# EAGLE design CAN_node_analog (EAGLE 7.2.0)
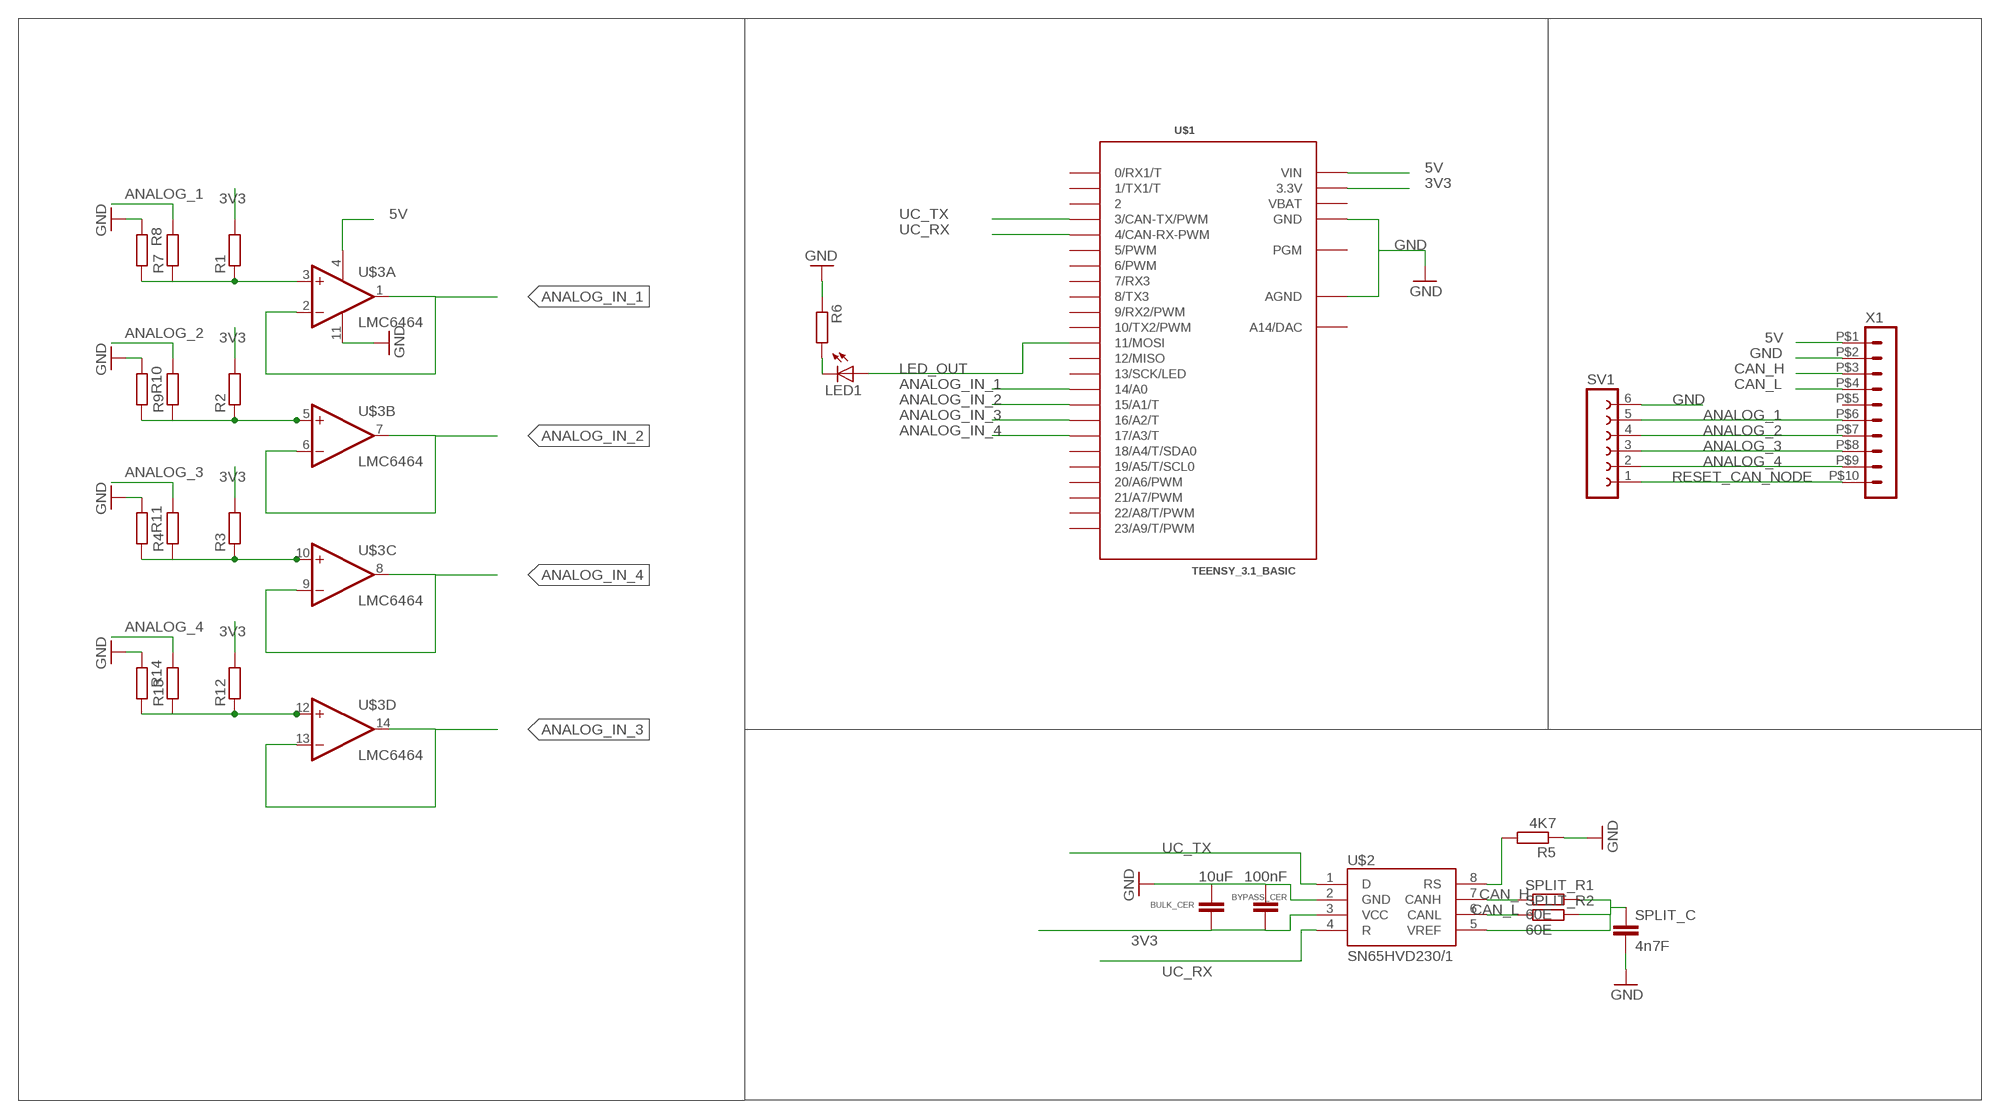
[diagram p0: schematic, sheet 1]

## Parts
BULK_CER  10uF  C-EUC0805  [C0805]
BYPASS_CER  100nF  C-EUC0805  [C0805]
LED1  LED1206  [LED-1206]
R1  R-EU_R0805  [R0805]
R2  R-EU_R0805  [R0805]
R3  R-EU_R0805  [R0805]
R4  R-EU_R0805  [R0805]
R5  4K7  R-EU_R0805  [R0805]
R6  R-EU_R0805  [R0805]
R7  R-EU_R0805  [R0805]
R8  R-EU_R0805  [R0805]
R9  R-EU_R0805  [R0805]
R10  R-EU_R0805  [R0805]
R11  R-EU_R0805  [R0805]
R12  R-EU_R0805  [R0805]
R13  R-EU_R0805  [R0805]
R14  R-EU_R0805  [R0805]
SPLIT_C  4n7F  C-EUC0805  [C0805]
SPLIT_R1  60E  R-EU_R0805  [R0805]
SPLIT_R2  60E  R-EU_R0805  [R0805]
SV1  FE06-1  [FE06]
U$1  TEENSY_3.1_BASIC  [TEENSY_3.1_BASIC]
U$2  SN65HVD230/1  [SO8]
U$3  LMC6464  [SO14_LONGPADS]
X1  HEADER_POS10_43045-1012  [43045-1012]

## Nets
3V3: BULK_CER.1 BYPASS_CER.1 R1.2 R2.2 R3.2 R12.2 U$1.3.3V U$1.3.3V1(3.3V) U$2.3(VCC)
5V: U$1.VIN U$3.4(POW:V+) X1.P$1
ANALOG_1: R7.2 SV1.5 X1.P$6
ANALOG_2: R9.2 SV1.4 X1.P$7
ANALOG_3: R4.2 SV1.3 X1.P$8
ANALOG_4: R13.2 SV1.2 X1.P$9
ANALOG_IN_1: U$1.14/A0 U$3.1(A:OUT) U$3.2(A:-IN)
ANALOG_IN_2: U$1.15/A1(15/A1/T) U$3.6(B:-IN) U$3.7(B:OUT)
ANALOG_IN_3: U$1.16/A2(16/A2/T) U$3.13(D:-IN) U$3.14(D:OUT)
ANALOG_IN_4: U$1.17/A3(17/A3/T) U$3.8(C:OUT) U$3.9(C:-IN)
CAN_H: SPLIT_R1.1 U$2.7(CANH) X1.P$3
CAN_L: SPLIT_R2.1 U$2.6(CANL) X1.P$4
GND: BULK_CER.2 BYPASS_CER.2 R5.1 R6.1 R8.1 R10.1 R11.1 R14.1 SPLIT_C.2 SV1.6 U$1.AGND U$1.GND U$1.GND1(GND) U$2.2(GND) U$3.11(POW:V-) X1.P$2
LED_OUT: LED1.A U$1.11(11/MOSI)
N$1: LED1.C R6.2
N$2: R1.1 R7.1 R8.2 U$3.3(A:+IN)
N$3: R2.1 R9.1 R10.2 U$3.5(B:+IN)
N$4: R3.1 R4.1 R11.2 U$3.10(C:+IN)
N$5: R5.2 U$2.8(RS)
N$6: R12.1 R13.1 R14.2 U$3.12(D:+IN)
N$9: SPLIT_C.1 SPLIT_R1.2 SPLIT_R2.2 U$2.5(VREF)
RESET_CAN_NODE: SV1.1 X1.P$10
UC_RX: U$1.4(4/CAN-RX-PWM) U$2.4(R)
UC_TX: U$1.3(3/CAN-TX/PWM) U$2.1(D)
Unconnected: U$1.0(0/RX1/T) U$1.1(1/TX1/T) U$1.2 U$1.5(5/PWM) U$1.6(6/PWM) U$1.7(7/RX3) U$1.8(8/TX3) U$1.9(9/RX2/PWM) U$1.10(10/TX2/PWM) U$1.12(12/MISO) U$1.13(13/SCK/LED) U$1.18/A4(18/A4/T/SDA0) U$1.19/A5(19/A5/T/SCL0) U$1.20/A6(20/A6/PWM) U$1.21/A7(21/A7/PWM) U$1.22/A8(22/A8/T/PWM) U$1.23/A9(23/A9/T/PWM) U$1.A14(A14/DAC) U$1.PGM X1.P$5

## Power pins joined to a net without a drawn wire
VBAT: U$1.VBAT

## Library data of the parts
BULK_CER BYPASS_CER SPLIT_C = LV:C-EU: CAPACITOR, European symbol
LED1 = IIT_BOMBAY_Racing:LED: LEDs Standard schematic elements and footprints for 5mm, 3mm, 1206, and 0603 sized LEDs. 5mm - Spark Fun Electronics SKU : COM-00529 (and others)
R1-R4 R6-R14 = IIT_BOMBAY_Racing:R-EU_: RESISTOR, European symbol
R5 SPLIT_R1 SPLIT_R2 = LV:R-EU_: RESISTOR, European symbol
SV1 = con-lsta:FE06-1: FEMALE HEADER; OC_FARNELL: unknown; OC_NEWARK: unknown
U$1 = IIT_BOMBAY_Racing:TEENSY_3.1_BASIC: Footprint for Teensy 3.1 board using all pin connections on the outer perimeter
U$2 = texas_1:SN65HVD230/1
U$3 = IIT_BOMBAY_Racing:LMC6464
X1 = con-molex-micro-fit-3_0:HEADER_POS10_?: Molex - Micro-Fit 3.0 Series connector, 3.00mm (0.118") pitch header, 10 positions.

## Board
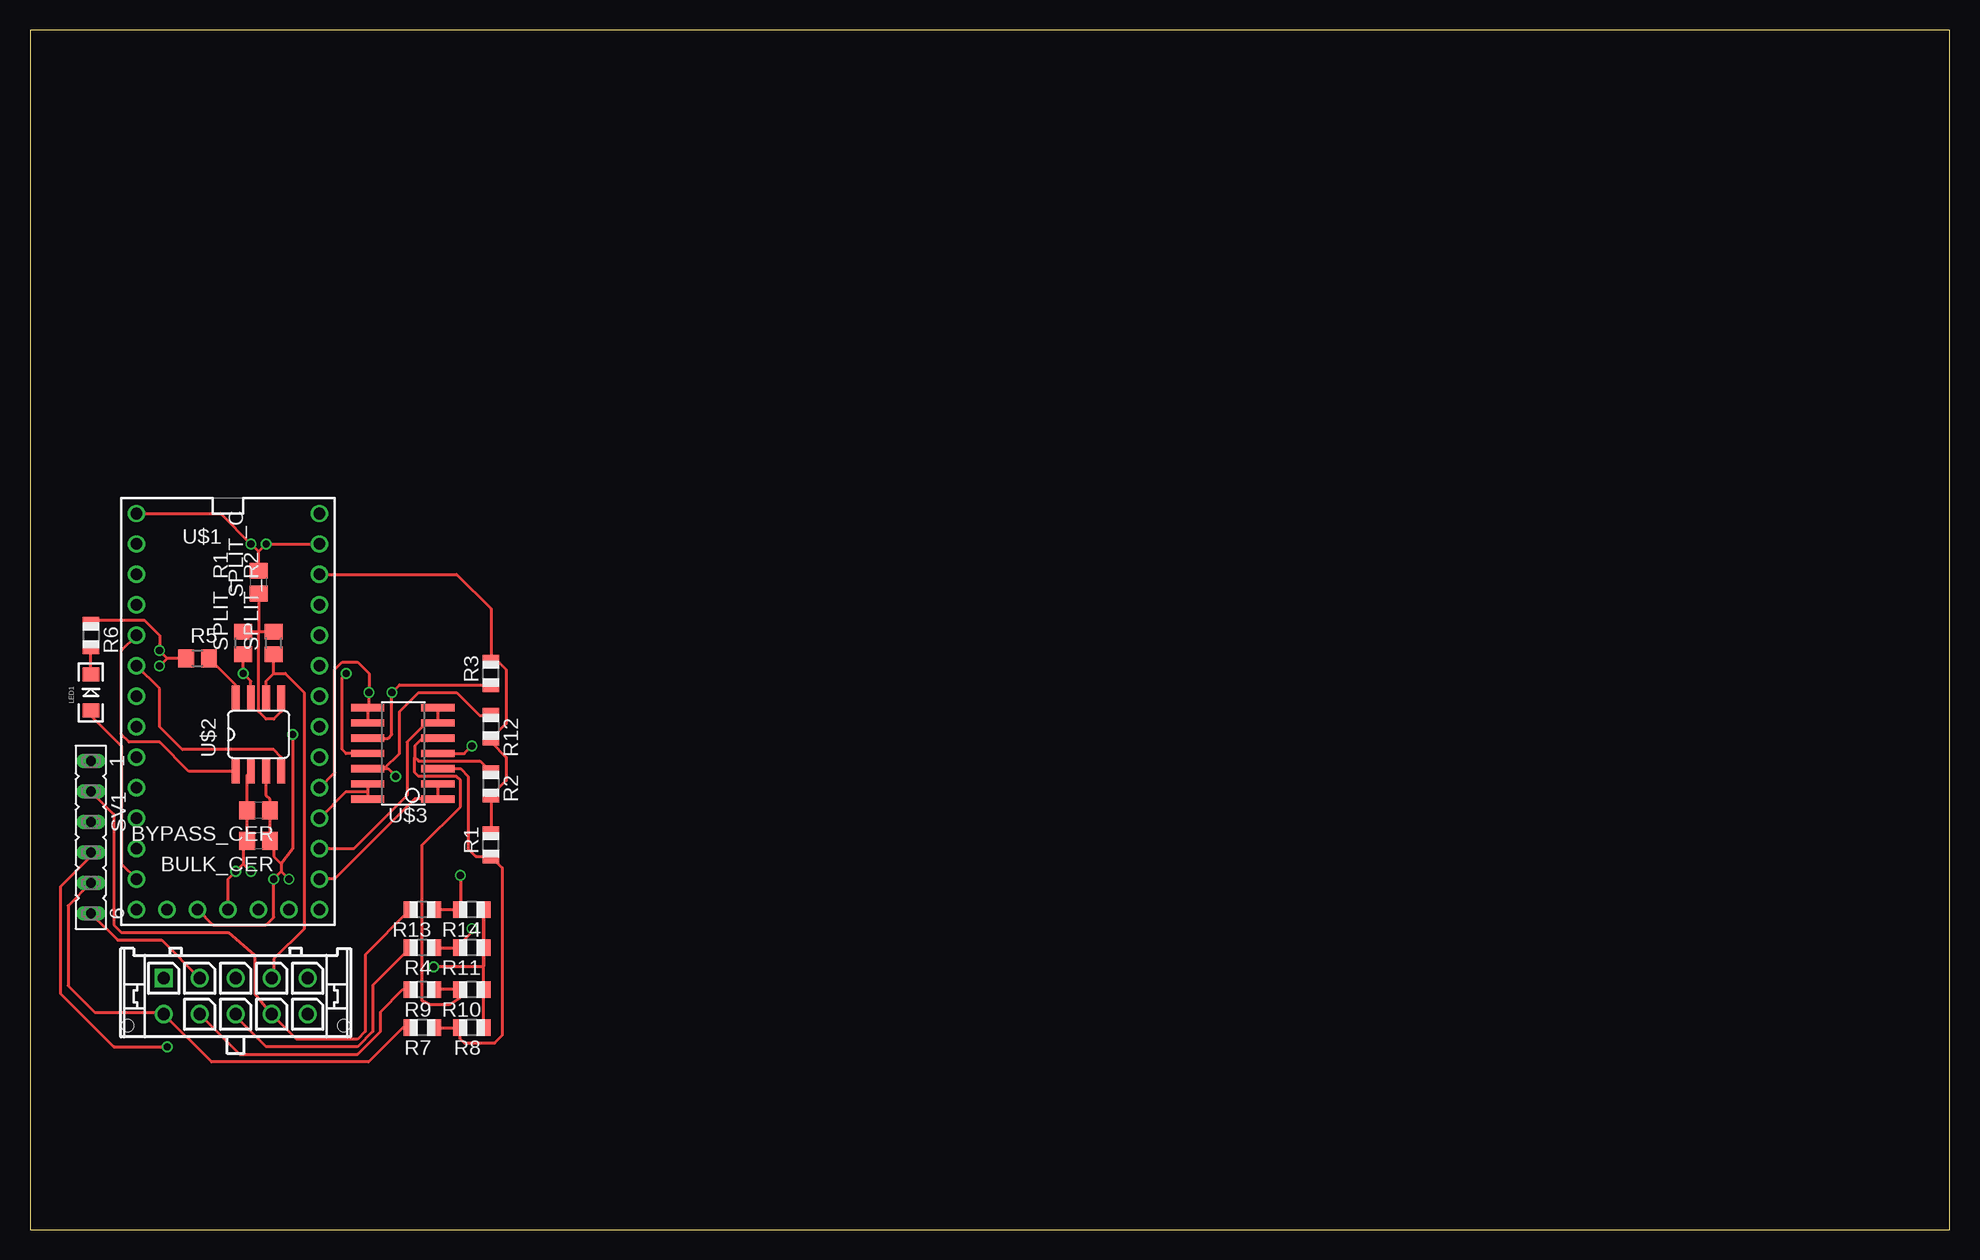
[diagram p1: board, top side]
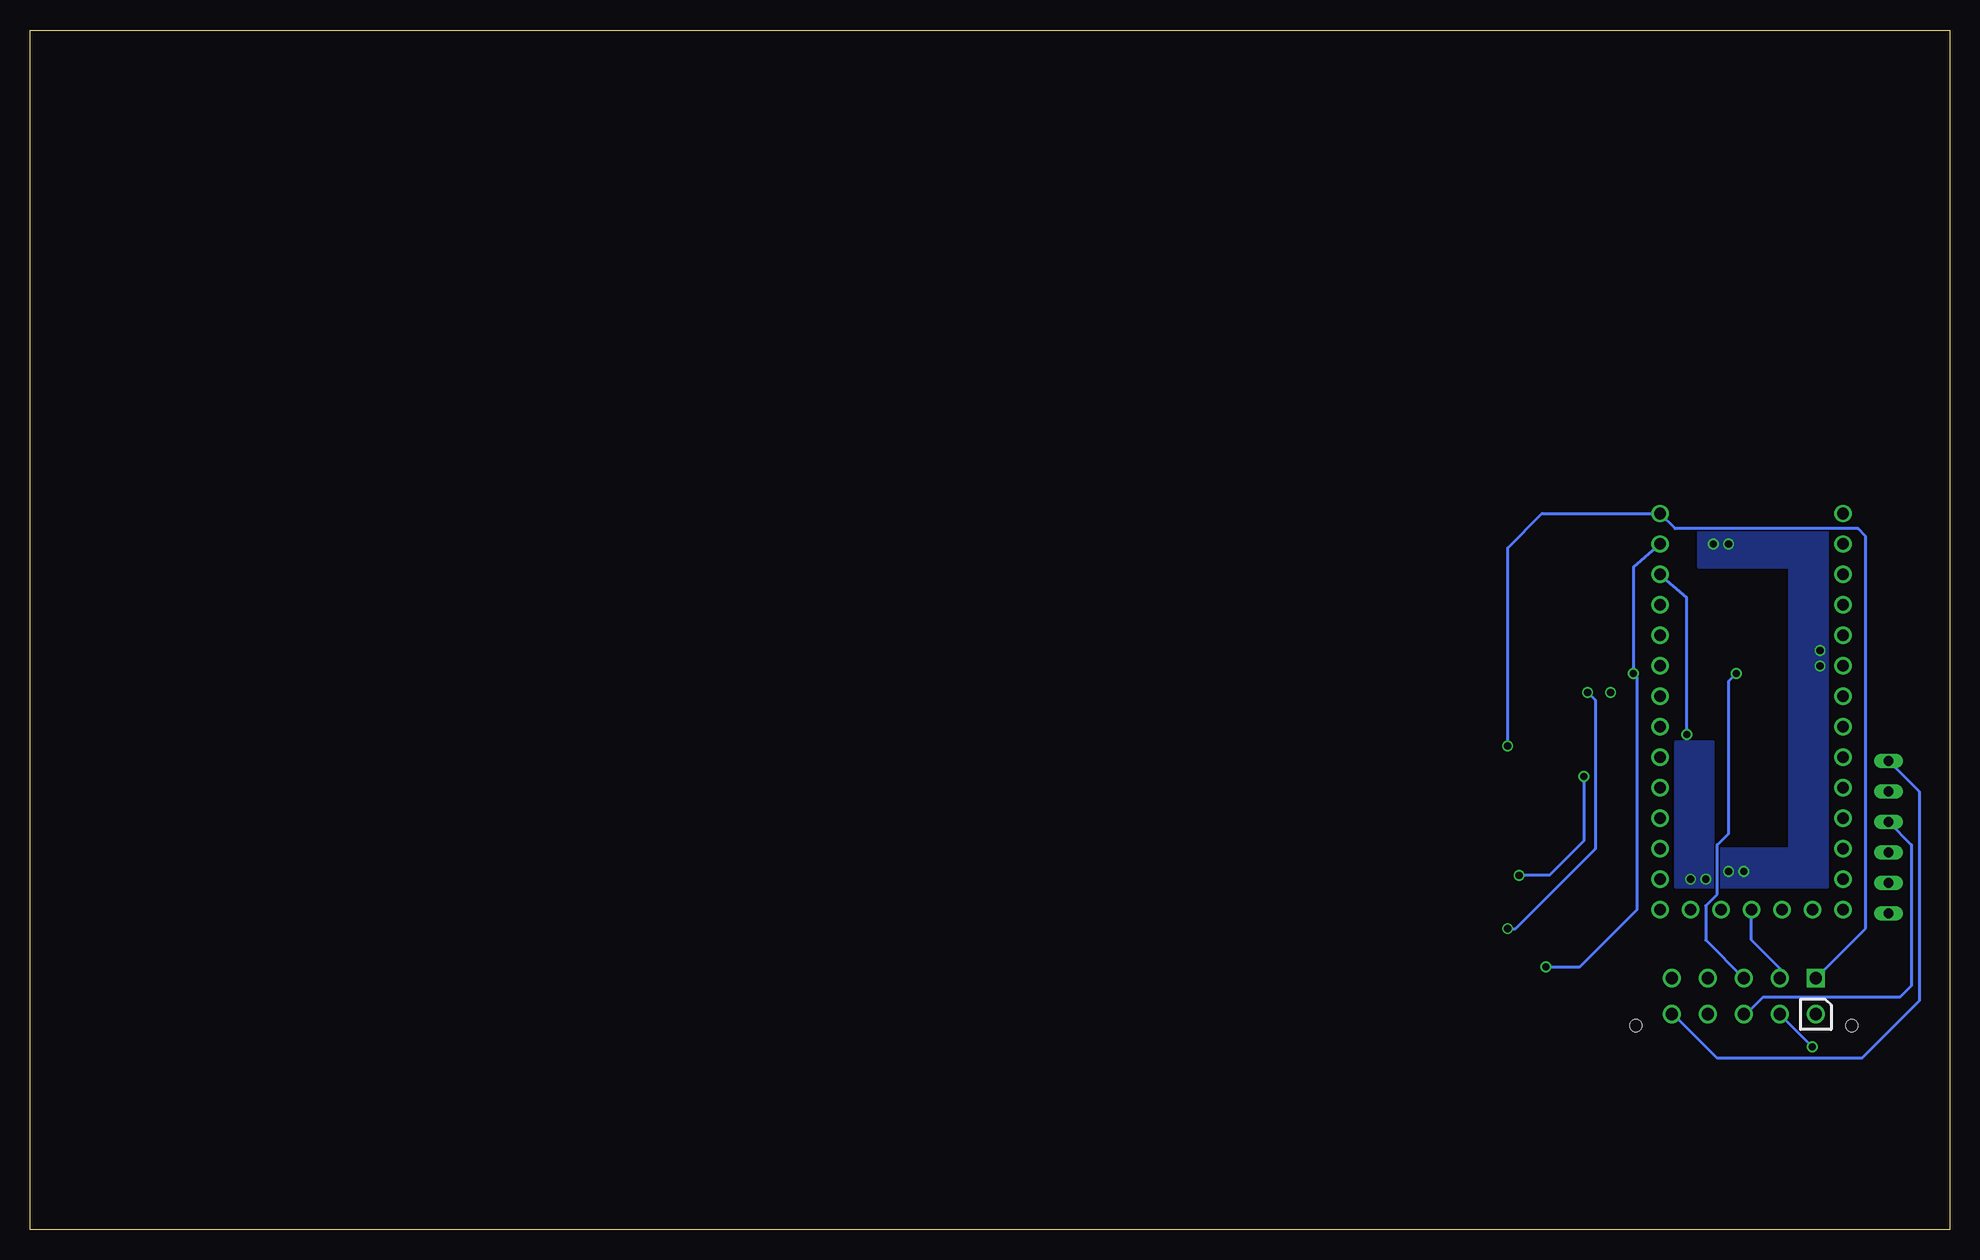
[diagram p2: board, bottom side, seen from below]

Size 160 x 100 mm. Coordinates in mm from the lower left corner, seen from the top.
Outline: 0,0 160,0 160,100 0,100 0,0
Copper layers (1*16): Top 0.035mm / dielectric 1.5mm / Bottom 0.035mm
Design rules "PCB_Power": minimum track width 5mil, minimum drill 10mil, track to track 5mil, track to pad 5mil, pad to pad 5mil, via to via 5mil, smd to smd 5mil, copper to edge 10mil, drill to drill 6mil, minimum pad ring 5mil, minimum via ring 5mil, stop-mask expansion 3mil, vias tented up to drill 0mil, thermal gap 10mil

### Footprints (pad centres in the part's own frame; a part is rotated, then mirrored left to right if it is on the bottom)
C0805 = smd 1.3 x 1.5: 1 -0.95,0; 2 0.95,0
LED-1206 = smd 1.2 x 1.4: A -1.5,0; C 1.5,0
R0805 = smd 1.1 x 1.4: 1 -1,0; 2 1,0
R0805' = smd 1.3 x 1.5: 1 -0.95,0; 2 0.95,0
FE06 = drill 0.813 long: 1 -6.35,0; 2 -3.81,0; 3 -1.27,0; 4 1.27,0; 5 3.81,0; 6 6.35,0
TEENSY_3.1_BASIC = drill 0.965: 0 -7.62,13.97; 1 -7.62,11.43; 2 -7.62,8.89; 3 -7.62,6.35; 3.3V 7.62,11.43; 3.3V1 -2.54,-16.51; 4 -7.62,3.81; 5 -7.62,1.27; 6 -7.62,-1.27; 7 -7.62,-3.81; 8 -7.62,-6.35; 9 -7.62,-8.89; 10 -7.62,-11.43; 11 -7.62,-13.97; 12 -7.62,-16.51; 13 7.62,-16.51; 14/A0 7.62,-13.97; 15/A1 7.62,-11.43; 16/A2 7.62,-8.89; 17/A3 7.62,-6.35; 18/A4 7.62,-3.81; 19/A5 7.62,-1.27; 20/A6 7.62,1.27; 21/A7 7.62,3.81; 22/A8 7.62,6.35; 23/A9 7.62,8.89; A14 5.08,-16.51; AGND 7.62,13.97; GND -7.62,16.51; GND1 0,-16.51; PGM 2.54,-16.51; VBAT -5.08,-16.51; VIN 7.62,16.51
SO8 = smd 0.66 x 2.032: 1 -1.905,-3.073; 2 -0.635,-3.073; 3 0.635,-3.073; 4 1.905,-3.073; 5 1.905,3.073; 6 0.635,3.073; 7 -0.635,3.073; 8 -1.905,3.073
SO14_LONGPADS = smd 0.61 x 2.762: 1 -6.35,-1.61; 2 -5.08,-1.61; 3 -3.81,-1.61; 4 -2.54,-1.61; 5 -1.27,-1.61; 6 0,-1.61; 7 1.27,-1.61; 8 1.27,4.226; 9 0,4.226; 10 -1.27,4.226; 11 -2.54,4.226; 12 -3.81,4.226; 13 -5.08,4.226; 14 -6.35,4.226
43045-1012 = drill 1.02 square: P$1 6,0 | drill 1.02: P$2 3,0; P$3 0,0; P$4 -3,0; P$5 -6,0; P$6 6,3; P$7 3,3; P$8 0,3; P$9 -3,3; P$10 -6,3 | hole 1.02: 9,3.94; -9,3.94

### Placement (x,y rotation side)
BULK_CER  19.05,32.38 180 top
BYPASS_CER  19.05,34.92 180 top
LED1  5.08,44.77 90 top
R1  38.42,32.07 90 top
R2  38.42,37.15 270 top
R3  38.42,46.35 90 top
R4  32.7,23.5 180 top
R5  4K7  [R0805']  13.97,47.62 0 top
R6  5.08,49.53 270 top
R7  32.7,16.83 180 top
R8  36.83,16.83 180 top
R9  32.7,20 180 top
R10  36.83,20 180 top
R11  36.83,23.5 180 top
R12  38.42,41.91 270 top
R13  32.7,26.67 180 top
R14  36.83,26.67 180 top
SPLIT_C  19.05,53.98 90 top
SPLIT_R1  60E  [R0805']  17.78,48.9 90 top
SPLIT_R2  60E  [R0805']  20.32,48.9 90 top
SV1  5.08,32.7 270 top
U$1  16.51,43.18 0 top
U$2  19.05,41.27 0 top
U$3  32.38,42.23 90 top
X1  17.14,20.95 180 top

### Tracks (layer width: path | path; a pad name or v marks a point on that pad's centre or on a via)
3V3  (via drill 0.6)
  Top 0.254: U$2.3 19.68,36.2 20,35.88 BYPASS_CER.1 BULK_CER.1 20.32,32.38 20.32,31.11 20.95,30.48 | 20.95,30.48 20.95,29.84 | 20.95,29.84 v20.32,29.21 20.32,26.04 19.68,25.4 15.24,25.4 U$1.3.3V1 | 20.95,29.84 v21.59,29.21 | v21.91,41.27 21.91,31.75 20.95,30.48 | R1.2 R2.2 39.69,37.42 39.69,39.37 38.42,40.64 R12.2 39.69,42.18 39.69,46.67 39.01,47.35 R3.2 38.42,51.75 35.56,54.61 U$1.3.3V
  Bottom 0.254: v21.91,41.27 21.91,52.7 U$1.3.3V
  pour Bottom: 19.68,28.57 19.68,40.64 22.86,40.64 22.86,28.57
5V  (via drill 0.6)
  Top 0.254: U$3.4 36.2,39.69 v36.83,40.32
  Bottom 0.254: X1.P$1 6.99,25.11 6.99,57.78 7.62,58.42 22.86,58.42 U$1.VIN 33.97,59.69 36.83,56.83 v36.83,40.32
ANALOG_1
  Top 0.254: 31.67,16.86 R7.2 31.07,16.83 28.21,13.97 15.13,13.97 X1.P$6 11,18.1 5.4,18.1 3.17,20.32 3.17,26.99 SV1.5
ANALOG_2  (via drill 0.6)
  Top 0.254: SV1.4 5.08,31.11 2.54,28.57 2.54,19.68 6.99,15.24 v11.43,15.24 | X1.P$7 17.5,14.61 27.3,14.61 29.21,16.51 29.21,18.14 31.07,20 R9.2
  Bottom 0.254: v11.43,15.24 X1.P$7
ANALOG_3
  Top 0.254: X1.P$8 17.14,17.78 19.68,15.24 27.3,15.24 28.57,16.51 28.57,20.37 R4.2
  Bottom 0.254: SV1.3 3.17,32.07 3.17,20.32 4.13,19.37 15.56,19.37 16.97,17.95 X1.P$8
ANALOG_4
  Top 0.254: SV1.2 6.99,34.61 6.99,25.4 7.62,24.77 16.51,24.77 18.73,22.86 18.73,19.68 X1.P$9 22.23,15.88 27.3,15.88 27.94,16.51 27.94,22.91 R13.2
ANALOG_IN_1
  Top 0.254: U$3.2 U$3.1 32.07,35.88 25.4,29.21 U$1.14/A0
ANALOG_IN_2
  Top 0.254: U$3.7 U$3.6 33.02,42.23 31.43,40.64 31.43,36.2 26.99,31.75 U$1.15/A1
ANALOG_IN_3
  Top 0.254: U$3.13 28.16,36.51 | 28.16,36.51 U$3.14 | U$1.16/A2 26.35,36.51 28.16,36.51
ANALOG_IN_4  (via drill 0.6)
  Top 0.254: U$3.9 U$3.8 28.26,43.5 v28.26,44.77 28.26,46.35 27.3,47.31 26.04,47.31 25.4,46.67 25.4,38.1 U$1.17/A3
CAN_H  (via drill 0.6)
  Top 0.254: U$2.7 18.41,45.72 v17.78,46.35 SPLIT_R1.1
  Bottom 0.254: v17.78,46.35 18.41,45.72 18.41,33.02 19.37,32.07 19.37,27.94 20.32,26.99 20.32,24.13 X1.P$3
CAN_L
  Top 0.254: 20.32,46.35 SPLIT_R2.1 | U$2.6 19.68,45.72 20.32,46.35 | 20.32,46.35 21.27,46.35 22.86,44.77 22.86,25.08 20.32,22.54 20.32,21.13 X1.P$4
GND  (via drill 0.6)
  Top 0.254: 13.34,47.62 R5.1 11.43,47.62 | v10.79,46.99 11.43,47.62 | 11.43,47.62 v10.79,48.26 10.79,49.53 9.53,50.8 5.35,50.8 R6.1 | 17.78,30.48 17.78,32.38 BULK_CER.2 BYPASS_CER.2 18.1,37.89 U$2.2 | 17.78,30.48 v17.14,29.84 16.51,29.21 U$1.GND1 | 17.78,30.48 v18.41,29.84 | 19.05,56.52 SPLIT_C.2 19.05,54.61 | 19.05,56.52 v18.41,57.15 15.88,59.69 U$1.GND | 19.05,56.52 v19.68,57.15 U$1.AGND | SV1.6 7.3,24.13 10.97,24.13 X1.P$2 | R8.1 R10.1 R11.1 R14.1 37.83,21.95 37.78,21.91 v33.66,21.91 | U$3.11 26.35,39.69 26.04,40.01 26.04,46.04 v26.35,46.35
  Bottom 0.254: X1.P$2 14.14,21.77 16.51,24.13 U$1.GND1 | v33.66,21.91 30.8,21.91 26.04,26.67 26.04,46.04 v26.35,46.35 26.35,55.24 U$1.AGND
  pour Bottom: 17.14,58.42 20.95,58.42 20.95,55.24 13.34,55.24 13.34,31.75 19.05,31.75 19.05,28.57 10.16,28.57 10.16,58.42
LED_OUT
  Top 0.254: LED1.A 5.08,42.86 7.62,40.32 7.62,30.48 U$1.11
N$1
  Top 0.254: LED1.C R6.2
N$2
  Top 0.254: R7.1 R8.2 35.83,15.92 36.2,15.56 38.73,15.56 39.37,16.19 39.37,30.16 38.42,31.11 38.37,31.11 | U$3.3 35.88,38.42 36.51,37.78 36.51,31.75 37.15,31.11 38.37,31.11 | 38.37,31.11 R1.1
N$3
  Top 0.254: R9.1 R10.2 35.83,19.32 34.92,18.73 33.34,18.73 32.7,19.05 32.7,32.07 35.88,35.24 35.88,37.47 35.56,37.78 32.38,37.78 32.07,38.1 32.07,39.37 | U$3.5 32.7,40.96 32.07,40.32 32.07,39.37 | 32.07,39.37 32.38,39.05 37.51,39.05 R2.1
N$4  (via drill 0.6)
  Top 0.254: R11.2 R4.1 35.56,23.5 36.83,24.77 v36.83,25.08 | U$3.10 29.84,40.96 30.16,41.27 v30.16,44.77 30.8,45.4 38.37,45.4 R3.1
  Bottom 0.254: v36.83,25.08 36.2,25.08 29.53,31.75 29.53,44.13 v30.16,44.77
N$5
  Top 0.254: U$2.8 17.14,45.4 R5.2
N$6  (via drill 0.6)
  Top 0.254: R13.1 R14.2 35.88,26.72 v35.88,29.53 | U$3.12 29.53,38.42 | 29.53,38.42 30.8,39.69 30.8,43.18 32.38,44.77 35.56,44.77 37.47,42.86 38.37,42.86 R12.1 | 29.53,38.42 29.84,38.42 v30.48,37.78
  Bottom 0.254: v35.88,29.53 33.34,29.53 30.48,32.38 v30.48,37.78
N$9
  Top 0.254: U$2.5 20.95,43.18 20.32,42.55 19.68,42.55 19.05,43.18 19.05,49.84 | SPLIT_R1.2 19.05,49.84 | 19.05,49.84 SPLIT_R2.2 | SPLIT_C.1 19.05,49.84
RESET_CAN_NODE
  Bottom 0.254: SV1.1 2.54,36.51 2.54,19.05 7.3,14.29 19.37,14.29 23.04,17.95 X1.P$10
UC_RX
  Top 0.254: U$2.4 20.95,39.37 20.32,40.01 12.7,40.01 10.79,41.91 10.79,45.09 U$1.4
UC_TX
  Top 0.254: U$2.1 13.23,38.2 10.79,40.64 8.26,40.64 7.62,41.27 7.62,48.26 U$1.3